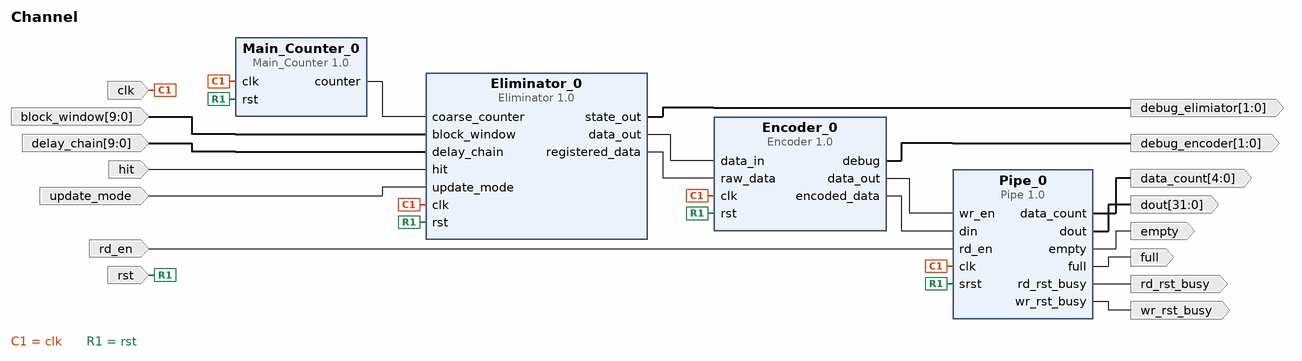
[diagram p0: block diagram of the top level]
# Vivado block design Channel, xck26-sfvc784-2LV-c, Vivado 2023.2
create_bd_design Channel

create_bd_port -dir I update_mode
create_bd_port -dir I -from 9 -to 0 block_window
create_bd_port -dir I rst
create_bd_port -dir I hit
create_bd_port -dir O -from 1 -to 0 debug_elimiator
create_bd_port -dir O -from 1 -to 0 debug_encoder
create_bd_port -dir I rd_en
create_bd_port -dir O full
create_bd_port -dir O empty
create_bd_port -dir O -from 31 -to 0 dout
create_bd_port -dir O wr_rst_busy
create_bd_port -dir O rd_rst_busy
create_bd_port -dir I -from 9 -to 0 delay_chain
create_bd_port -dir I clk
create_bd_port -dir O -from 4 -to 0 data_count

create_bd_cell -type ip -vlnv xilinx.com:user:Main_Counter:1.0 Main_Counter_0
create_bd_cell -type ip -vlnv xilinx.com:user:Encoder:1.0 Encoder_0
create_bd_cell -type ip -vlnv xilinx.com:user:Eliminator:1.0 Eliminator_0
create_bd_cell -type ip -vlnv xilinx.com:user:Pipe:1.0 Pipe_0

# ---- connections ----

connect_bd_net [get_bd_pins Eliminator_0/data_out] [get_bd_pins Encoder_0/data_in]
connect_bd_net [get_bd_pins Eliminator_0/registered_data] [get_bd_pins Encoder_0/raw_data]
connect_bd_net [get_bd_pins Eliminator_0/state_out] [get_bd_ports debug_elimiator]
connect_bd_net [get_bd_pins Encoder_0/data_out] [get_bd_pins Pipe_0/wr_en]
connect_bd_net [get_bd_pins Encoder_0/debug] [get_bd_ports debug_encoder]
connect_bd_net [get_bd_pins Encoder_0/encoded_data] [get_bd_pins Pipe_0/din]
connect_bd_net [get_bd_pins Main_Counter_0/counter] [get_bd_pins Eliminator_0/coarse_counter]
connect_bd_net [get_bd_ports clk] [get_bd_pins Main_Counter_0/clk] [get_bd_pins Encoder_0/clk] [get_bd_pins Eliminator_0/clk] [get_bd_pins Pipe_0/clk]
connect_bd_net [get_bd_pins Pipe_0/data_count] [get_bd_ports data_count]
connect_bd_net [get_bd_pins Pipe_0/dout] [get_bd_ports dout]
connect_bd_net [get_bd_pins Pipe_0/empty] [get_bd_ports empty]
connect_bd_net [get_bd_pins Pipe_0/full] [get_bd_ports full]
connect_bd_net [get_bd_pins Pipe_0/rd_rst_busy] [get_bd_ports rd_rst_busy]
connect_bd_net [get_bd_pins Pipe_0/wr_rst_busy] [get_bd_ports wr_rst_busy]
connect_bd_net [get_bd_ports block_window] [get_bd_pins Eliminator_0/block_window]
connect_bd_net [get_bd_ports delay_chain] [get_bd_pins Eliminator_0/delay_chain]
connect_bd_net [get_bd_ports hit] [get_bd_pins Eliminator_0/hit]
connect_bd_net [get_bd_ports rd_en] [get_bd_pins Pipe_0/rd_en]
connect_bd_net [get_bd_ports rst] \
  [get_bd_pins Main_Counter_0/rst] [get_bd_pins Eliminator_0/rst] [get_bd_pins Encoder_0/rst] [get_bd_pins Pipe_0/srst]
connect_bd_net [get_bd_ports update_mode] [get_bd_pins Eliminator_0/update_mode]

validate_bd_design
save_bd_design
